# Altium schematic sheet DIGITAL_IO.SchDoc: Peripherals
size B; Author: Michael Jones; Engineer: Michael Jones; Organization: Group VIII Technology; Address1: 1652 W 820 N; Address2: Provo; Address3: UT  84601; Address4: 801-379-0118; DocumentNumber: 5; Revision: A3; SheetNumber: 4; SheetTotal: 7
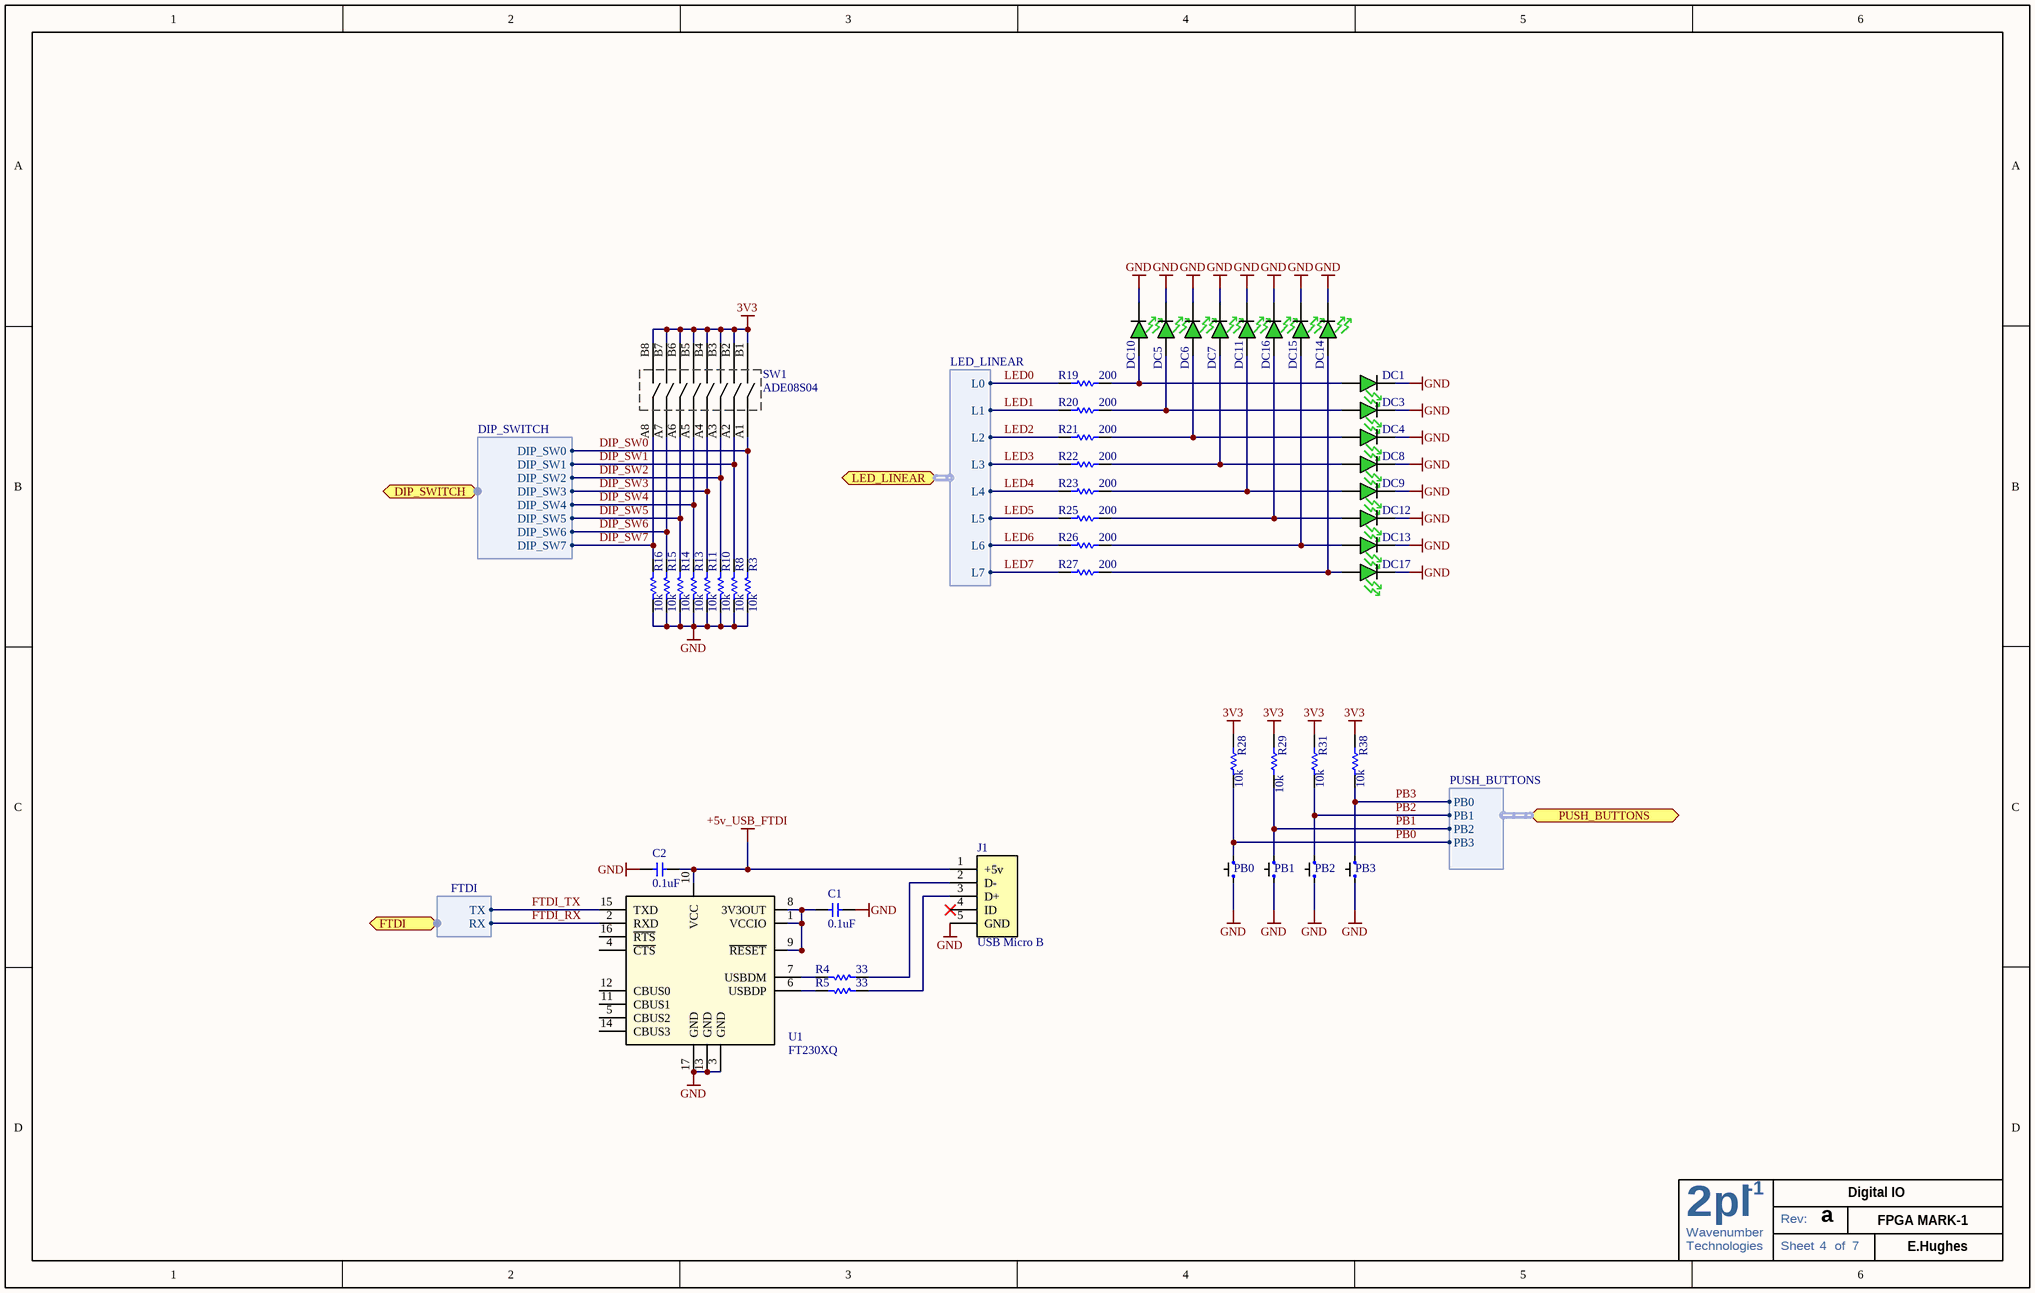
[diagram p0: DIGITAL_IO.SchDoc]

## Parts
C1  0.1uF  [C0603]
C2  0.1uF  [C0603]
DC1  LED 1.6X0.8MM 570NM GRN CLR SMD  [LED_0603 - GREEN]  (value not drawn)
DC3  LED 1.6X0.8MM 570NM GRN CLR SMD  [LED_0603 - GREEN]  (value not drawn)
DC4  LED 1.6X0.8MM 570NM GRN CLR SMD  [LED_0603 - GREEN]  (value not drawn)
DC5  LED 1.6X0.8MM 570NM GRN CLR SMD  [LED_0603 - GREEN]  (value not drawn)
DC6  LED 1.6X0.8MM 570NM GRN CLR SMD  [LED_0603 - GREEN]  (value not drawn)
DC7  LED 1.6X0.8MM 570NM GRN CLR SMD  [LED_0603 - GREEN]  (value not drawn)
DC8  LED 1.6X0.8MM 570NM GRN CLR SMD  [LED_0603 - GREEN]  (value not drawn)
DC9  LED 1.6X0.8MM 570NM GRN CLR SMD  [LED_0603 - GREEN]  (value not drawn)
DC10  LED 1.6X0.8MM 570NM GRN CLR SMD  [LED_0603 - GREEN]  (value not drawn)
DC11  LED 1.6X0.8MM 570NM GRN CLR SMD  [LED_0603 - GREEN]  (value not drawn)
DC12  LED 1.6X0.8MM 570NM GRN CLR SMD  [LED_0603 - GREEN]  (value not drawn)
DC13  LED 1.6X0.8MM 570NM GRN CLR SMD  [LED_0603 - GREEN]  (value not drawn)
DC14  LED 1.6X0.8MM 570NM GRN CLR SMD  [LED_0603 - GREEN]  (value not drawn)
DC15  LED 1.6X0.8MM 570NM GRN CLR SMD  [LED_0603 - GREEN]  (value not drawn)
DC16  LED 1.6X0.8MM 570NM GRN CLR SMD  [LED_0603 - GREEN]  (value not drawn)
DC17  LED 1.6X0.8MM 570NM GRN CLR SMD  [LED_0603 - GREEN]  (value not drawn)
J1  USB Micro B  [10103594-0001LF - Testing Smaller Thru]
PB0  FSM4JSMA  [FSM4JSMA]  (value not drawn)
PB1  FSM4JSMA  [FSM4JSMA]  (value not drawn)
PB2  FSM4JSMA  [FSM4JSMA]  (value not drawn)
PB3  FSM4JSMA  [FSM4JSMA]  (value not drawn)
R3  10k  [R0603]
R4  33  [R0603]
R5  33  [R0603]
R8  10k  [R0603]
R10  10k  [R0603]
R11  10k  [R0603]
R13  10k  [R0603]
R14  10k  [R0603]
R15  10k  [R0603]
R16  10k  [R0603]
R19  200  [R0603]
R20  200  [R0603]
R21  200  [R0603]
R22  200  [R0603]
R23  200  [R0603]
R25  200  [R0603]
R26  200  [R0603]
R27  200  [R0603]
R28  10k  [R0603]
R29  10k  [R0603]
R31  10k  [R0603]
R38  10k  [R0603]
SW1  ADE08S04  [ADE08S04]
U1  FT230XQ  [FT230x-QFN65P400X400X80-16L]

## Ports
DIP_SWITCH (harness DIP_SWITCH), FTDI (harness FTDI), LED_LINEAR (harness LED_LINEAR), PUSH_BUTTONS (harness PUSH_BUTTONS)

## Harnesses
DIP_SWITCH: DIP_SW0, DIP_SW1, DIP_SW2, DIP_SW3, DIP_SW4, DIP_SW5, DIP_SW6, DIP_SW7
PUSH_BUTTONS: PB0, PB1, PB2, PB3
LED_LINEAR: L0, L1, L2, L3, L4, L5, L6, L7
FTDI: TX, RX

## Nets
3V3: R28.2 R29.2 R31.2 R38.2 SW1.B1 SW1.B2 SW1.B3 SW1.B4 SW1.B5 SW1.B6 SW1.B7 SW1.B8
+5v_USB_FTDI: C2.2 J1.1(+5v) U1.10(VCC)
GND: C1.1 C2.1 DC1.C DC3.C DC4.C DC5.C DC6.C DC7.C DC8.C DC9.C DC10.C DC11.C DC12.C DC13.C DC14.C DC15.C DC16.C DC17.C J1.5(GND) PB0.A PB1.A PB2.A PB3.A R3.1 R8.1 R10.1 R11.1 R13.1 R14.1 R15.1 R16.1 U1.3(GND) U1.13(GND) U1.17(GND)
DIP_SW0: R3.2 SW1.A1 ; port DIP_SWITCH.DIP_SW0
DIP_SW1: R8.2 SW1.A2 ; port DIP_SWITCH.DIP_SW1
DIP_SW2: R10.2 SW1.A3 ; port DIP_SWITCH.DIP_SW2
DIP_SW3: R11.2 SW1.A4 ; port DIP_SWITCH.DIP_SW3
DIP_SW4: R13.2 SW1.A5 ; port DIP_SWITCH.DIP_SW4
DIP_SW5: R14.2 SW1.A6 ; port DIP_SWITCH.DIP_SW5
DIP_SW6: R15.2 SW1.A7 ; port DIP_SWITCH.DIP_SW6
DIP_SW7: R16.2 SW1.A8 ; port DIP_SWITCH.DIP_SW7
FTDI_RX: U1.2(RXD) ; port FTDI.RX
FTDI_TX: U1.15(TXD) ; port FTDI.TX
LED0: R19.2 ; port LED_LINEAR.L0
LED1: R20.2 ; port LED_LINEAR.L1
LED2: R21.2 ; port LED_LINEAR.L2
LED3: R22.2 ; port LED_LINEAR.L3
LED4: R23.2 ; port LED_LINEAR.L4
LED5: R25.2 ; port LED_LINEAR.L5
LED6: R26.2 ; port LED_LINEAR.L6
LED7: R27.2 ; port LED_LINEAR.L7
PB0: PB0.B R28.1 ; port PUSH_BUTTONS.PB3
PB1: PB1.B R29.1 ; port PUSH_BUTTONS.PB2
PB2: PB2.B R31.1 ; port PUSH_BUTTONS.PB1
PB3: PB3.B R38.1 ; port PUSH_BUTTONS.PB0
NetC1_2: C1.2 U1.1(VCCIO) U1.8(3V3OUT) U1.9(~{RESET})
NetDC1_A: DC1.A DC10.A R19.1
NetDC3_A: DC3.A DC5.A R20.1
NetDC4_A: DC4.A DC6.A R21.1
NetDC7_A: DC7.A DC8.A R22.1
NetDC9_A: DC9.A DC11.A R23.1
NetDC12_A: DC12.A DC16.A R25.1
NetDC13_A: DC13.A DC15.A R26.1
NetDC14_A: DC14.A DC17.A R27.1
NetJ1_2: J1.2(D-) R4.1
NetJ1_3: J1.3(D+) R5.1
NetR4_2: R4.2 U1.7(USBDM)
NetR5_2: R5.2 U1.6(USBDP)

Not connected (* = marked no-connect by the designer): J1 4(ID)*; U1 4(~{CTS}) 5(CBUS2) 11(CBUS1) 12(CBUS0) 14(CBUS3) 16(~{RTS})

## Notes on the sheet
- a
- Digital IO
- FPGA MARK-1
- E.Hughes
- 2
- Wavenumber
- pl
- -1
- Rev:
- Technologies
- Sheet
- of

## Library data of the parts
C1 C2 = GRM188R71H104KA93D: CAP CER .1UF 50V 10% X7R 0603; Manufacturer: Murata Electronics North America; Capacitance: 0.1µF; Value: 0.1uF; Supplier 1: Digi-Key; Supplier Part Number 1: 490-1519-1-ND; Manufacturer Part Number: GRM188R71H104KA93D; RoHS: RoHS Compliant; Category: Capacitors; Stock 1: 6315460; Pricing 1: 10=0.037, 100=0.0221, 500=0.01276, 1000=0.00884 (USD); Voltage - Rated: 50V; Tolerance: ±10%; Temperature Coefficient: X7R; Mounting Type: Surface Mount, MLCC; Operating Temperature: -55°C ~ 125°C; Features: -; Applications: General Purpose; Ratings: -; Package / Case: 0603 (1608 Metric); Size / Dimension: 0.063" L x 0.031" W (1.60mm x 0.80mm); Lead Spacing: -; Thickness: 0.80mm; Packaging: Cut Tape (CT); Lead Style: -; ComponentLink1URL: http://search.murata.co.jp/Ceramy/image/img/PDF/ENG/GRM188R71H104KA93.pdf; ComponentLink1Description: http://search.murata.co.jp/Ceramy/image/img/PDF/ENG/GRM188R71H104KA93.pdf
DC1 DC3-DC17 = APT1608CGCK: Manufacturer: Kingbright Corp; Current - Test: 20mA; Wavelength - Peak: 574nm; Millicandela Rating: 50mcd; Voltage - Forward (Vf) Typ: 2.1V; Lens Type: Clear; Lens Style/Size: Rectangle, 1.2mm x 0.8mm; Viewing Angle: 120°; Value: LED 1.6X0.8MM 570NM GRN CLR SMD; Supplier 1: Digi-Key; Supplier Part Number 1: 754-1116-2-ND; Manufacturer Part Number: APT1608CGCK; RoHS: RoHS Compliant; Description: LED 1.6X0.8MM 570NM GRN CLR SMD; Category: Optoelectronics; Stock 1: 94000; Pricing 1: 2000=0.051, 6000=0.045, 10000=0.043 (USD); Color: Green; Luminous Flux @ Current - Test: -; Wavelength - Dominant: 570nm; Size / Dimension: 1.60mm L x 0.80mm W; Height: 0.75mm; Package / Case: 0603 (1608 Metric); Mounting Type: Surface Mount; Packaging: Tape & Reel (TR); ComponentLink1URL: http://www.us.kingbright.com/images/catalog/SPEC/APT1608CGCK.pdf; ComponentLink1Description: http://www.us.kingbright.com/images/catalog/SPEC/APT1608CGCK.pdf
J1 = 10103594-0001LF - USB Micro: CONN RCPT STD MICRO USB TYPE B; Manufacturer: FCI; Connector Type: USB - micro B; Number of Contacts: 5; Gender: Receptacle; Specifications: USB 2.0; Micro USB B: Value; Notes: Similar to; Supplier 1: Digi-Key; Manufacturer Part Number: 10103594-0001LF; RoHS: RoHS Compliant; Category: Connectors, Interconnects; Stock 1: 23288; Pricing 1: 1=1.1, 10=0.768, 100=0.517, 250=0.43912, 500=0.41716 (USD); Mounting Type: Surface Mount, Right Angle, Horizontal; Features: Shielded, Solder Retention; Packaging: Cut Tape (CT); Ingress Protection: -; ComponentLink1URL: http://portal.fciconnect.com/res/en/pdffiles/doc_search/10103594.pdf; ComponentLink1Description: http://portal.fciconnect.com/res/en/pdffiles/doc_search/10103594.pdf; Supplier Part Number 1: 609-4050-1-ND; Value: USB Micro B
PB0-PB3 = FSM4JSMATR: SWITCH TACTILE SPST-NO 0.05A 12V; Manufacturer: TE Connectivity; Switch Function: Off-Mom; Contact Rating @ Voltage: 0.05A @ 12VDC; Actuator Type: Standard; Outline: 6.00mm x 6.00mm; Illumination: Non-Illuminated; Operating Force: 160gf; Supplier 1: Digi-Key; Supplier Part Number 1: 450-1759-2-ND; Manufacturer Part Number: FSM4JSMATR; RoHS: RoHS Compliant; Category: Switches; Stock 1: 40800; Pricing 1: 1200=0.154, 2400=0.141, 6000=0.132, 8400=0.123, 12000=0.119, 30000=0.117, 60000=0.115 (USD); Circuit: SPST-NO; Mounting Type: Surface Mount; Termination Style: Gull Wing; Orientation: Vertical; Packaging: Tape & Reel (TR); ComponentLink1URL: http://documents.tycoelectronics.com/commerce/DocumentDelivery/DDEController?Action=srchrtrv&DocNm=2-1437565-7&DocType=CD&DocLang=EN; ComponentLink1Description: http://documents.tycoelectronics.com/commerce/DocumentDelivery/DDEController?Action=srchrtrv&DocNm=2-1437565-7&DocType=CD&DocLang=EN; Value: FSM4JSMA
R3 R8 R10 R11 R13-R16 R28 R29 R31 R38 = ERJ-3EKF1002V: RES 10.0K OHM 1/10W 1% 0603 SMD; Manufacturer: Panasonic - ECG; Power (Watts): 0.1W, 1/10W; Temperature Coefficient: ±100ppm/°C; Manufacturer Part Number: ERJ-3EKF1002V; Value: 10k; Supplier 1: Digi-Key; RoHS: RoHS Compliant; Category: Resistors; Stock 1: 11168880; Pricing 1: 1=0.04, 50=0.015, 100=0.0114, 250=0.00844, 500=0.00624, 1000=0.00416 (USD); Resistance (Ohms): 10.0K; Composition: Thick Film; Features: -; Tolerance: ±1%; Size / Dimension: 0.063" L x 0.031" W (1.60mm x 0.80mm); Height: 0.018" (0.45mm); Lead Style: Surface Mount (SMD - SMT); Packaging: Cut Tape (CT); Package / Case: 0603 (1608 Metric); ComponentLink1URL: http://industrial.panasonic.com/www-cgi/jvcr13pz.cgi?E+PZ+3+AOA0002+ERJ3EKF1002V+7+WW; ComponentLink1Description: http://industrial.panasonic.com/www-cgi/jvcr13pz.cgi?E+PZ+3+AOA0002+ERJ3EKF1002V+7+WW; Supplier Part Number 1: P10.0KHCT-ND
R4 R5 = ERJ-3EKF33R0V: RES 33.0 OHM 1/10W 1% 0603 SMD; Manufacturer: Panasonic - ECG; Power (Watts): 0.1W, 1/10W; Temperature Coefficient: ±100ppm/°C; Value: 33; Supplier 1: Digi-Key; Manufacturer Part Number: ERJ-3EKF33R0V; RoHS: RoHS Compliant; Category: Resistors; Stock 1: 1263163; Pricing 1: 1=0.04, 50=0.0138, 100=0.0105, 250=0.0078, 500=0.00576, 1000=0.00384 (USD); Resistance (Ohms): 33; Composition: Thick Film; Features: -; Tolerance: ±1%; Size / Dimension: 0.063" L x 0.031" W (1.60mm x 0.80mm); Height: 0.018" (0.45mm); Number of Terminations: 2; Packaging: Cut Tape (CT); Package / Case: 0603 (1608 Metric); ComponentLink1URL: http://industrial.panasonic.com/www-cgi/jvcr13pz.cgi?E+PZ+3+AOA0002+ERJ3EKF33R0V+7+WW; ComponentLink1Description: http://industrial.panasonic.com/www-cgi/jvcr13pz.cgi?E+PZ+3+AOA0002+ERJ3EKF33R0V+7+WW; Supplier Part Number 1: P33.0HCT-ND
R19-R23 R25-R27 = ERJ-3EKF2000V: RES 200 OHM 1/10W 1% 0603 SMD; Manufacturer: Panasonic - ECG; Power (Watts): 0.1W, 1/10W; Temperature Coefficient: ±100ppm/°C; Manufacturer Part Number: ERJ-3EKF2000V; Value: RES 200 OHM 1/10W 1% 0603 SMD; Supplier 1: Digi-Key; Supplier Part Number 1: P200HCT-ND; RoHS: RoHS Compliant; Category: Resistors; Stock 1: 1279595; Pricing 1: 1=0.04, 50=0.015, 100=0.0114, 250=0.00844, 500=0.00624, 1000=0.00416 (USD); Resistance (Ohms): 200; Composition: Thick Film; Features: -; Tolerance: ±1%; Size / Dimension: 0.063" L x 0.031" W (1.60mm x 0.80mm); Height: 0.018" (0.45mm); Lead Style: Surface Mount (SMD - SMT); Packaging: Cut Tape (CT); Package / Case: 0603 (1608 Metric); ComponentLink1URL: http://industrial.panasonic.com/www-cgi/jvcr13pz.cgi?E+PZ+3+AOA0002+ERJ3EKF2000V+7+WW; ComponentLink1Description: http://industrial.panasonic.com/www-cgi/jvcr13pz.cgi?E+PZ+3+AOA0002+ERJ3EKF2000V+7+WW
SW1 = ADE08S04: SWITCH DIP SPST EXT ACT 8POS SMD; Manufacturer: TE Connectivity; Number of Positions: 8; Contact Rating @ Voltage: 0.4VA @ 20VAC/DC; Actuator Type: Standard; Actuator Level: Raised; Washable: Yes; Supplier 1: Digi-Key; Supplier Part Number 1: 1-1825058-9-ND; Manufacturer Part Number: ADE08S04; RoHS: RoHS Compliant; Category: Switches; Stock 1: 28135; Pricing 1: 1=1, 10=0.879, 50=0.7926, 100=0.7581, 250=0.68916, 500=0.62024, 1000=0.55133, 5000=0.48241, 10000=0.45829 (USD); Circuit: SPST; Mounting Type: Surface Mount; Orientation: Top Actuated; ComponentLink1URL: http://documents.tycoelectronics.com/commerce/DocumentDelivery/DDEController?Action=srchrtrv&DocNm=1825058&DocType=CD&DocLang=EN; ComponentLink1Description: http://documents.tycoelectronics.com/commerce/DocumentDelivery/DDEController?Action=srchrtrv&DocNm=1825058&DocType=CD&DocLang=EN; Value: ADE08S04
U1 = FT230XQ-R: IC USB SERIAL BASIC UART QFN-16; Manufacturer: FTDI, Future Technology Devices International Ltd; Number of Channels: 1, UART; FIFO's: 512 Byte; Protocol: RS-232, RS-422, RS-485; Voltage - Supply: 3.3 V ~ 5 V; With Auto Flow Control: Yes; With Modem Control: No; Supplier 1: Digi-Key; Manufacturer Part Number: FT230XQ-R; RoHS: RoHS Compliant; Category: Integrated Circuits (ICs); Stock 1: 4560; Pricing 1: 1=2.3, 10=2.07, 25=1.9552, 50=1.84, 100=1.725, 250=1.61, 500=1.5525, 1000=1.5295 (USD); Features: USB to UART with Battery Detection; With Parallel Port: *; With IrDA Encoder/Decoder: *; With False Start Bit Detection: *; With CMOS: Yes; Mounting Type: Surface Mount; Package / Case: 16-VQFN Exposed Pad; Supplier Device Package: 16-QFN-EP (4x4); Packaging: Cut Tape (CT); ComponentLink1URL: http://www.ftdichip.com/Support/Documents/DataSheets/ICs/DS_FT230X.pdf; ComponentLink1Description: http://www.ftdichip.com/Support/Documents/DataSheets/ICs/DS_FT230X.pdf; Value: FT230XQ